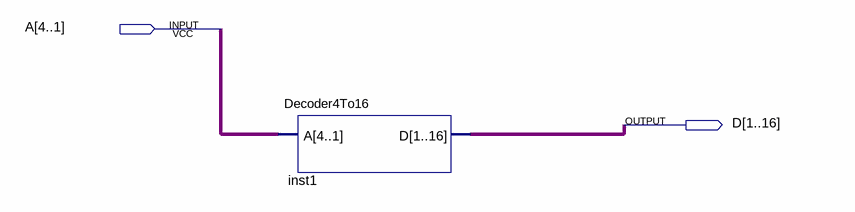
[diagram p0: schematic sheet]
// Quartus schematic lab6.bdf as structural Verilog: 1 symbols, 2 pins
module lab6 (
  input  [4:1] A,
  output [1:16] D
);

  Decoder4To16 inst1 (.A(A), .D(D));
endmodule
